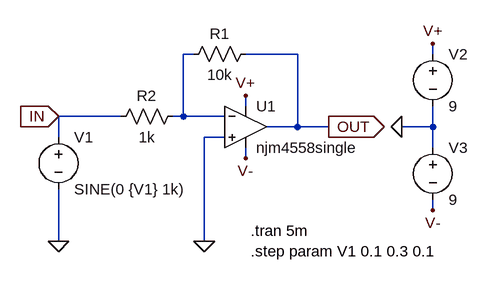
[diagram p0: schematic Circuit7_03.asc]
Circuit7_03.asc, the LTspice schematic file:
Version 4
SHEET 1 880 680
WIRE 80 160 64 160
WIRE 240 160 160 160
WIRE 448 160 448 144
WIRE 160 240 160 224
WIRE -32 256 -128 256
WIRE 64 256 64 160
WIRE 64 256 48 256
WIRE 128 256 64 256
WIRE 240 272 240 160
WIRE 240 272 192 272
WIRE 288 272 240 272
WIRE 448 272 448 240
WIRE 448 272 400 272
WIRE -128 288 -128 256
WIRE 128 288 96 288
WIRE 448 304 448 272
WIRE 160 320 160 304
WIRE 448 400 448 384
WIRE -128 448 -128 368
WIRE 96 448 96 288
FLAG 400 272 0
FLAG -128 256 IN
IOPIN -128 256 In
FLAG 288 272 OUT
IOPIN 288 272 Out
FLAG -128 448 0
FLAG 160 320 V-
FLAG 160 224 V+
FLAG 448 144 V+
FLAG 448 400 V-
FLAG 96 448 0
SYMBOL voltage -128 272 R0
SYMATTR InstName V1
SYMATTR Value SINE(0 {V1} 1k)
SYMBOL voltage 448 144 R0
SYMATTR InstName V2
SYMATTR Value 9
SYMBOL voltage 448 288 R0
SYMATTR InstName V3
SYMATTR Value 9
SYMBOL res 176 144 R90
WINDOW 0 0 56 VBottom 2
WINDOW 3 32 56 VTop 2
SYMATTR InstName R1
SYMATTR Value 10k
SYMBOL res 64 240 R90
WINDOW 0 0 56 VBottom 2
WINDOW 3 32 56 VTop 2
SYMATTR InstName R2
SYMATTR Value 1k
SYMBOL NJR_OPamp/njm4558single 160 208 R0
SYMATTR InstName U1
TEXT 168 432 Left 2 !.tran 5m\n.step param V1 0.1 0.3 0.1

The netlist it stands for:
* Circuit7_03.asc
V1 IN 0 SINE(0 {V1} 1k)
V2 V+ 0 9
V3 0 V- 9
R1 OUT N001 10k
R2 N001 IN 1k
* U1: njm4558single (symbol NJR_OPamp/njm4558single not available, pins judged from their places): In+=0 In-=N001 V+=V+ V-=V- OUT=OUT
.tran 5m
.step param V1 0.1 0.3 0.1
.backanno
.end